# Altium project NAVIGATION.PrjPcb (part 2 of 2)

## Sheet NAVIGATION - SERVO.SchDoc
size A4; SheetNumber: 5; SheetTotal: 7
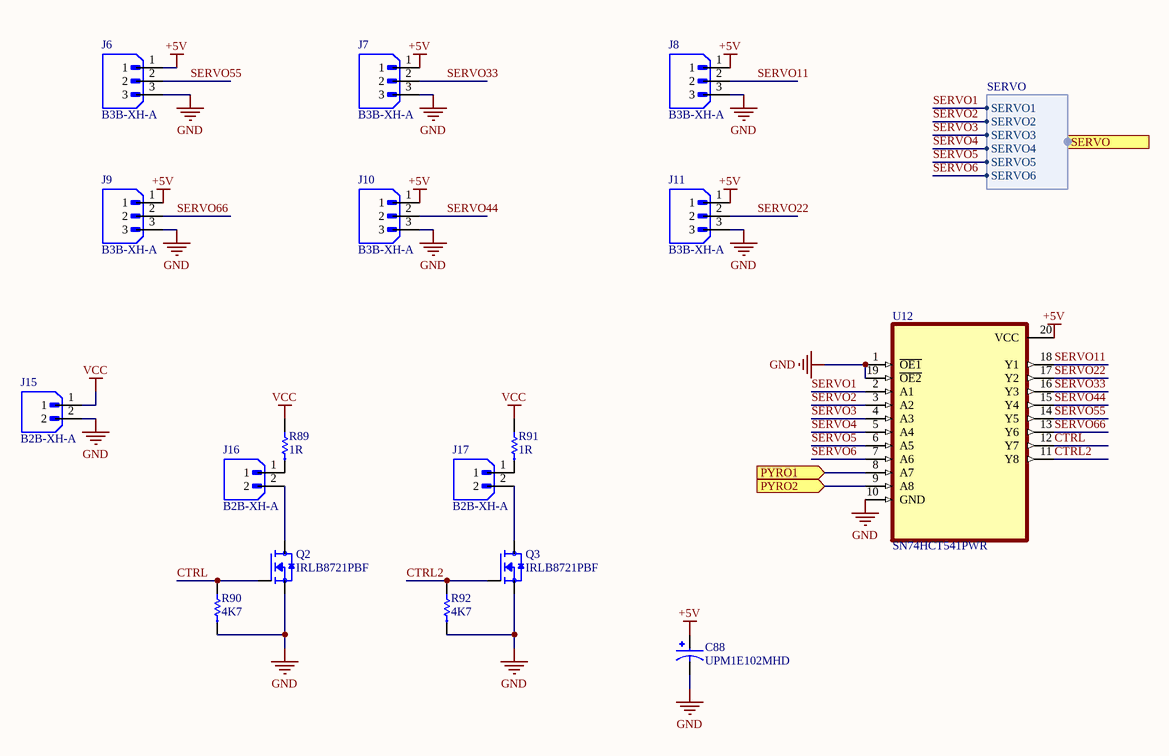
[diagram p6: NAVIGATION - SERVO.SchDoc]

### Parts
C88  UPM1E102MHD  [CAPPRD500W80D1250H2700]
J6  B3B-XH-A  [JST_B3B-XH-A]
J7  B3B-XH-A  [JST_B3B-XH-A]
J8  B3B-XH-A  [JST_B3B-XH-A]
J9  B3B-XH-A  [JST_B3B-XH-A]
J10  B3B-XH-A  [JST_B3B-XH-A]
J11  B3B-XH-A  [JST_B3B-XH-A]
J15  B2B-XH-A  [JST_B2B-XH-A]
J16  B2B-XH-A  [JST_B2B-XH-A]
J17  B2B-XH-A  [JST_B2B-XH-A]
Q2  IRLB8721PBF  [TO254P1067X483X2057-3]
Q3  IRLB8721PBF  [TO254P1067X483X2057-3]
R89  1R  [RES-CHP0402-0.35H]
R90  4K7  [RES-CHP0402-0.35H]
R91  1R  [RES-CHP0402-0.35H]
R92  4K7  [RES-CHP0402-0.35H]
U12  SN74HCT541PWR  [SOP65P640X120-20N]

### Ports
PYRO1 (in), PYRO2 (in), SERVO (harness SERVO)

### Harnesses
SERVO: SERVO1, SERVO2, SERVO3, SERVO4, SERVO5, SERVO6

### Nets
+5V: C88.P J6.1 J7.1 J8.1 J9.1 J10.1 J11.1 U12.20(VCC)
GND: C88.N J6.3 J7.3 J8.3 J9.3 J10.3 J11.3 J15.2 Q2.3(S) Q3.3(S) R90.1 R92.1 U12.1(~{OE1}) U12.10(GND) U12.19(~{OE2})
VCC: J15.1 R89.2 R91.2
CTRL: Q2.1(G) R90.2 U12.12(Y7)
CTRL2: Q3.1(G) R92.2 U12.11(Y8)
PYRO: U12.8(A7) ; port PYRO1
PYROC2: U12.9(A8) ; port PYRO2
SERVO1: U12.2(A1) ; port SERVO.SERVO1
SERVO2: U12.3(A2) ; port SERVO.SERVO2
SERVO3: U12.4(A3) ; port SERVO.SERVO3
SERVO4: U12.5(A4) ; port SERVO.SERVO4
SERVO5: U12.6(A5) ; port SERVO.SERVO5
SERVO6: U12.7(A6) ; port SERVO.SERVO6
SERVO11: J8.2 U12.18(Y1)
SERVO22: J11.2 U12.17(Y2)
SERVO33: J7.2 U12.16(Y3)
SERVO44: J10.2 U12.15(Y4)
SERVO55: J6.2 U12.14(Y5)
SERVO66: J9.2 U12.13(Y6)
NetJ16_1: J16.1 R89.1
NetJ16_2: J16.2 Q2.2(D)
NetJ17_1: J17.1 R91.1
NetJ17_2: J17.2 Q3.2(D)

### Library data of the parts
C88 = UPM1E102MHD: Capacitor Aluminum Electrolytic Cap1000uF 25V 20% Radial 12.5X25 LS 5mm | Nichicon UPM1E102MHD; SnapEDA_Link: https://www.snapeda.com/parts/UPM1E102MHD/Nichicon/view-part/?ref=snap; Package: Radial Nichicon; Value: *; MF: Nichicon; MP: UPM1E102MHD; Check_prices: https://www.snapeda.com/parts/UPM1E102MHD/Nichicon/view-part/?ref=eda
J6-J11 = B3B-XH-A: Connector Header Through Hole 3 position 0.098 (2.50mm); MF: JST Sales; SnapEDA_Link: https://www.snapeda.com/parts/B3B-XH-A/JST+Sales+America+Inc./view-part/?ref=snap; Package: None; Value: *; MP: B3B-XH-A; Check_prices: https://www.snapeda.com/parts/B3B-XH-A/JST+Sales+America+Inc./view-part/?ref=eda
J15-J17 = B2B-XH-A: MF: {'manufacturer': u'JST Sales America Inc.'}; Package: None; Price: None; Value: *; MP: B2B-XH-A; Availability: Unavailable
Q2 Q3 = IRLB8721PBF: IRLB8721PBF N-channel MOSFET Transistor, 62 A, 30 V, 3-Pin TO-220AB | Infineon IRLB8721PBF; MF: Infineon Technologies; SnapEDA_Link: https://www.snapeda.com/parts/IRLB8721PBF/Infineon/view-part/?ref=snap; Package: TO-220-3 Infineon; Value: *; MP: IRLB8721PBF; Check_prices: https://www.snapeda.com/parts/IRLB8721PBF/Infineon/view-part/?ref=eda
R89-R92 = RESCHP0001 0R 1% 0402 SMD: RES CHP 0R 1% 1/16W 0402 SMD; MFR PN: NA; LINE: SMT; UNIT: PCS; TMG CODE: None; CLASS: B; MOUNT: SMD; TYPE: EP; TMG PN: RESCHP0001; CERTIFICATION: NA; ComponentLink1Description: Datasheet; ComponentLink1URL: https://datasheet.lcsc.com/lcsc/2207281800_Sunway-SC0402F0000I2ANRH_C3152056.pdf; Footprint: 0402
U12 = SN74HCT541PWR: Package: None; Price: None; Value: *; MP: SN74HCT541PWR; Availability: Unavailable

## Nets that join several sheets
3.3VA: NAVIGATION - POWER (C17.2 FB3.2), NAVIGATION - MCU (77 pins), NAVIGATION-PHERIPHERAL (24 pins)
+5V: NAVIGATION - POWER (5 pins), NAVIGATION-PHERIPHERAL (6 pins), NAVIGATION - SERVO (8 pins)
GND: NAVIGATION - POWER (29 pins), NAVIGATION - MCU (68 pins), NAVIGATION-PHERIPHERAL (48 pins), NAVIGATION - SERVO (15 pins)
CTS: NAVIGATION - MCU (R18.2), NAVIGATION-PHERIPHERAL (U8.12)
EXTINT: NAVIGATION - MCU (R14.2), NAVIGATION-PHERIPHERAL (U7.4)
IMU_CS: NAVIGATION - MCU (R23.2), NAVIGATION-PHERIPHERAL (U9.12)
IMU_INT: NAVIGATION - MCU (R24.2), NAVIGATION-PHERIPHERAL (U9.4)
IMU_SCLK: NAVIGATION - MCU (R22.2), NAVIGATION-PHERIPHERAL (U9.13)
IMU_SDIO: NAVIGATION - MCU (R20.2), NAVIGATION-PHERIPHERAL (U9.1)
IMU_SDO: NAVIGATION - MCU (R21.2), NAVIGATION-PHERIPHERAL (U9.14)
MAG_C1: NAVIGATION - MCU (R84.1), NAVIGATION-PHERIPHERAL (U10.4)
MAG_CS: NAVIGATION - MCU (R35.2), NAVIGATION-PHERIPHERAL (U10.10)
MAG_DRDY: NAVIGATION - MCU (R83.1), NAVIGATION-PHERIPHERAL (U10.8)
MAG_INT: NAVIGATION - MCU (R31.2), NAVIGATION-PHERIPHERAL (U10.7)
MAG_SCL: NAVIGATION - MCU (R34.2), NAVIGATION-PHERIPHERAL (U10.1)
MAG_SDA: NAVIGATION - MCU (R32.2), NAVIGATION-PHERIPHERAL (U10.11)
MAG_SDO: NAVIGATION - MCU (R33.2), NAVIGATION-PHERIPHERAL (U10.9)
NetR76_1: NAVIGATION - MCU (R76.1), NAVIGATION-PHERIPHERAL (R77.1 U7.8)
NetR78_1: NAVIGATION - MCU (R78.1), NAVIGATION-PHERIPHERAL (R79.1 U8.5)
NRST: NAVIGATION - MCU (C47.2 R47.1 U5.14), NAVIGATION-PHERIPHERAL (J4.10)
NRST1: NAVIGATION - MCU (C30.2 R9.1 U4.14), NAVIGATION-PHERIPHERAL (J13.10)
NRST2: NAVIGATION - MCU (C64.2 R62.1 U6.14), NAVIGATION-PHERIPHERAL (J14.10)
ON/SLEEP: NAVIGATION - MCU (R19.2), NAVIGATION-PHERIPHERAL (U8.13)
PYRO: NAVIGATION - MCU (R88.1), NAVIGATION - SERVO (U12.8)
PYROC2: NAVIGATION - MCU (R93.1), NAVIGATION - SERVO (U12.9)
RST: NAVIGATION - MCU (R17.2), NAVIGATION-PHERIPHERAL (U8.16)
SD_CLK: NAVIGATION - MCU (R36.2), NAVIGATION-PHERIPHERAL (J5.P5)
SD_CMD: NAVIGATION - MCU (R41.2), NAVIGATION-PHERIPHERAL (J5.P3)
SD_DAT0: NAVIGATION - MCU (R40.2), NAVIGATION-PHERIPHERAL (J5.P7)
SD_DAT1: NAVIGATION - MCU (R39.2), NAVIGATION-PHERIPHERAL (J5.P8)
SD_DAT2: NAVIGATION - MCU (R38.2), NAVIGATION-PHERIPHERAL (J5.P1)
SD_DAT3: NAVIGATION - MCU (R37.2), NAVIGATION-PHERIPHERAL (J5.P2)
SD_DET: NAVIGATION - MCU (R45.2), NAVIGATION-PHERIPHERAL (J5.P9)
SERVO1: NAVIGATION - MCU (R71.2), NAVIGATION - SERVO (U12.2)
SERVO2: NAVIGATION - MCU (R72.2), NAVIGATION - SERVO (U12.3)
SERVO3: NAVIGATION - MCU (R73.2), NAVIGATION - SERVO (U12.4)
SERVO4: NAVIGATION - MCU (R70.1), NAVIGATION - SERVO (U12.5)
SERVO5: NAVIGATION - MCU (R65.1), NAVIGATION - SERVO (U12.6)
SERVO6: NAVIGATION - MCU (R67.1), NAVIGATION - SERVO (U12.7)
SPI2_MISO: NAVIGATION - MCU (R43.2), NAVIGATION-PHERIPHERAL (U11.6)
SPI2_MOSI: NAVIGATION - MCU (R42.2), NAVIGATION-PHERIPHERAL (U11.7)
SPI2_NSS: NAVIGATION - MCU (R46.2), NAVIGATION-PHERIPHERAL (U11.4 U11.5)
SPI2_SCK: NAVIGATION - MCU (R44.2), NAVIGATION-PHERIPHERAL (U11.8)
SWCLK: NAVIGATION - MCU (R29.2), NAVIGATION-PHERIPHERAL (J4.4)
SWCLK2: NAVIGATION - MCU (R49.2), NAVIGATION-PHERIPHERAL (J13.4)
SWCLK3: NAVIGATION - MCU (R86.2), NAVIGATION-PHERIPHERAL (J14.4)
SWDIO: NAVIGATION - MCU (R30.2), NAVIGATION-PHERIPHERAL (J4.2)
SWDIO2: NAVIGATION - MCU (R50.2), NAVIGATION-PHERIPHERAL (J13.2)
SWDIO3: NAVIGATION - MCU (R87.2), NAVIGATION-PHERIPHERAL (J14.2)
TIMEPUL: NAVIGATION - MCU (R13.2), NAVIGATION-PHERIPHERAL (LD5.1 U7.3)
UART7_Rx: NAVIGATION - MCU (R11.2), NAVIGATION-PHERIPHERAL (U7.20)
UART7_Tx: NAVIGATION - MCU (R12.2), NAVIGATION-PHERIPHERAL (U7.21)
USART3_RX: NAVIGATION - MCU (R16.2), NAVIGATION-PHERIPHERAL (U8.2)
USART3_TX: NAVIGATION - MCU (R15.2), NAVIGATION-PHERIPHERAL (U8.3)
USB2_N: NAVIGATION - MCU (R52.2), NAVIGATION-PHERIPHERAL (J12.2)
USB2_P: NAVIGATION - MCU (R51.2), NAVIGATION-PHERIPHERAL (J12.3)
USB_N: NAVIGATION - MCU (R28.2), NAVIGATION-PHERIPHERAL (J3.2)
USB_P: NAVIGATION - MCU (R27.2), NAVIGATION-PHERIPHERAL (J3.3)